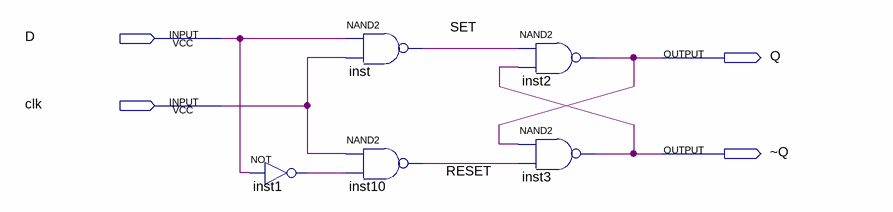
[diagram p0: schematic sheet]
// Quartus schematic FFD.bdf as structural Verilog: 5 symbols, 4 pins
module FFD (
  input  D,
  input  clk,
  output Q,
  output \~Q 
);

  wire inst1_out, RESET, SET;

  not inst1 (inst1_out, D);
  nand inst (SET, D, clk);
  nand inst10 (RESET, clk, inst1_out);
  nand inst2 (Q, SET, \~Q );
  nand inst3 (\~Q , Q, RESET);
endmodule
